# Altium project RK3399_SOM_BOARD.PrjPcb (part 4 of 4)

## Sheet SP3_PMIC.SchDoc
size A3; Date: 07.08.2025; CheckedBy: Own Check; CompanyName: No Company; DocumentNumber: ELK.PCB.0005.0005.A.A; Revision: V0.0.1; SheetNumber: 22; SheetTotal: 22
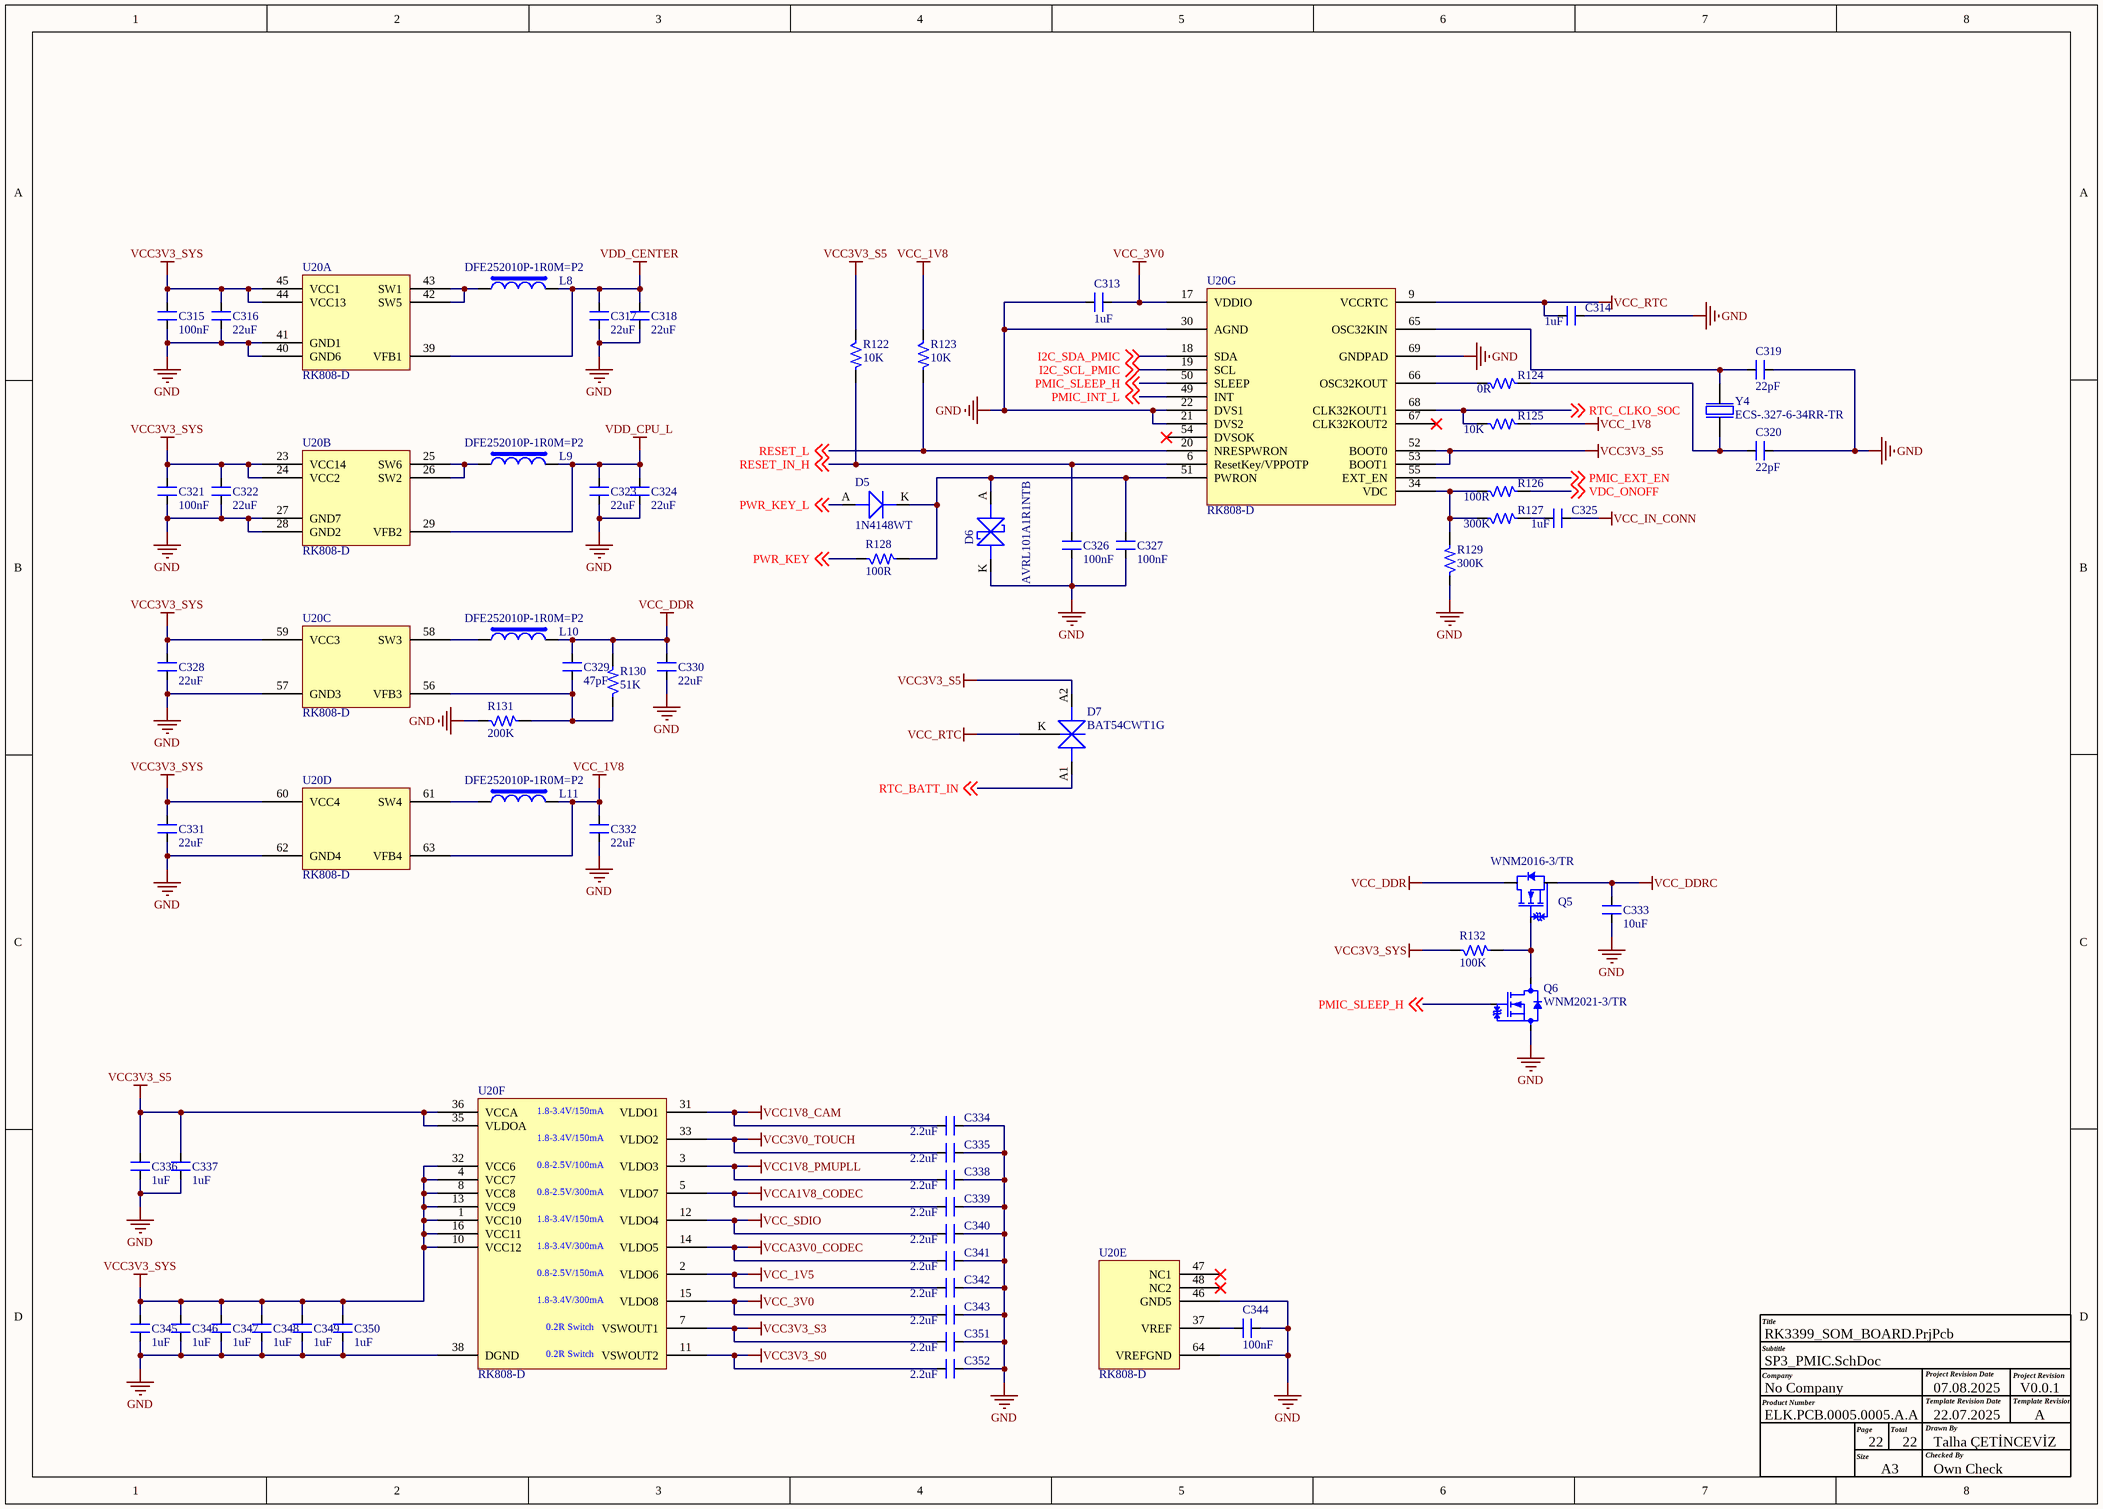
[diagram p20: SP3_PMIC.SchDoc]

### Parts
C313  1uF  [CAP_0402]
C314  1uF  [CAP_0402]
C315  100nF  [CAP_0402]
C316  22uF  [CAP_0603]
C317  22uF  [CAP_0603]
C318  22uF  [CAP_0603]
C319  22pF  [CAP_0402]
C320  22pF  [CAP_0402]
C321  100nF  [CAP_0402]
C322  22uF  [CAP_0603]
C323  22uF  [CAP_0603]
C324  22uF  [CAP_0603]
C325  1uF  [CAP_0402]
C326  100nF  [CAP_0402]
C327  100nF  [CAP_0402]
C328  22uF  [CAP_0603]
C329  47pF  [CAP_0402]
C330  22uF  [CAP_0603]
C331  22uF  [CAP_0603]
C332  22uF  [CAP_0603]
C333  10uF  [CAP_0402]
C334  2.2uF  [CAP_0402]
C335  2.2uF  [CAP_0402]
C336  1uF  [CAP_0402]
C337  1uF  [CAP_0402]
C338  2.2uF  [CAP_0402]
C339  2.2uF  [CAP_0402]
C340  2.2uF  [CAP_0402]
C341  2.2uF  [CAP_0402]
C342  2.2uF  [CAP_0402]
C343  2.2uF  [CAP_0402]
C344  100nF  [CAP_0402]
C345  1uF  [CAP_0402]
C346  1uF  [CAP_0402]
C347  1uF  [CAP_0402]
C348  1uF  [CAP_0402]
C349  1uF  [CAP_0402]
C350  1uF  [CAP_0402]
C351  2.2uF  [CAP_0402]
C352  2.2uF  [CAP_0402]
D5  1N4148WT  [DIO_SOD523]
D6  AVRL101A1R1NTB  [DIO_0402_SMD]
D7  BAT54CWT1G  [DIO_SOT-323-3]
L8  DFE252010P-1R0M=P2  [IND_1008]
L9  DFE252010P-1R0M=P2  [IND_1008]
L10  DFE252010P-1R0M=P2  [IND_1008]
L11  DFE252010P-1R0M=P2  [IND_1008]
Q5  WNM2016-3/TR  [SOT 23-3]
Q6  WNM2021-3/TR  [SOT-323-3]
R122  10K  [RES_0402]
R123  10K  [RES_0402]
R124  0R  [RES_0402]
R125  10K  [RES_0402]
R126  100R  [RES_0402]
R127  300K  [RES_0402]
R128  100R  [RES_0402]
R129  300K  [RES_0402]
R130  51K  [RES_0402]
R131  200K  [RES_0402]
R132  100K  [RES_0402]
U20  RK808-D  [QFN68_13.7_220.4X220.4_SMD]  (parts A,B,C,D,E,F,G of 7)
Y4  ECS-.327-6-34RR-TR  [XTAL_ECS-.327-6-34RR-TR]

### Nets
GND: C313.2 C314.1 C315.1 C316.1 C317.1 C318.1 C319.1 C320.1 C321.1 C322.1 C323.1 C324.1 C326.1 C327.1 C328.1 C330.1 C331.1 C332.1 C333.1 C334.2 C335.2 C336.1 C337.1 C338.2 C339.2 C340.2 C341.2 C342.2 C343.2 C344.1 C345.1 C346.1 C347.1 C348.1 C349.1 C350.1 C351.2 C352.2 D6.K Q6.2(S) R129.1 R131.1 U20.21(DVS2) U20.22(DVS1) U20.27(GND7) U20.28(GND2) U20.30(AGND) U20.38(DGND) U20.40(GND6) U20.41(GND1) U20.46(GND5) U20.57(GND3) U20.62(GND4) U20.64(VREFGND) U20.69(GNDPAD)
VCC1V8_CAM: C334.1 U20.31(VLDO1)
VCC1V8_PMUPLL: C338.1 U20.3(VLDO3)
VCC3V0_TOUCH: C335.1 U20.33(VLDO2)
VCC3V3_S0: C352.1 U20.11(VSWOUT2)
VCC3V3_S3: C351.1 U20.7(VSWOUT1)
VCC3V3_S5: C336.2 C337.2 D7.A2 R122.1 U20.35(VLDOA) U20.36(VCCA) U20.52(BOOT0) U20.53(BOOT1)
VCC3V3_SYS: C315.2 C316.2 C321.2 C322.2 C328.2 C331.2 C345.2 C346.2 C347.2 C348.2 C349.2 C350.2 R132.1 U20.1(VCC10) U20.4(VCC7) U20.8(VCC8) U20.10(VCC12) U20.13(VCC9) U20.16(VCC11) U20.23(VCC14) U20.24(VCC2) U20.32(VCC6) U20.44(VCC13) U20.45(VCC1) U20.59(VCC3) U20.60(VCC4)
VCC_1V5: C342.1 U20.2(VLDO6)
VCC_1V8: C332.2 L11.2 R123.1 R125.2 U20.63(VFB4)
VCC_3V0: C313.1 C343.1 U20.15(VLDO8) U20.17(VDDIO)
VCC_DDR: C329.2 C330.2 L10.2 Q5.3(D) R130.2
VCC_DDRC: C333.2 Q5.2(S)
VCC_IN_CONN: C325.1
VCC_RTC: C314.2 D7.K U20.9(VCCRTC)
VCC_SDIO: C340.1 U20.12(VLDO4)
VCCA1V8_CODEC: C339.1 U20.5(VLDO7)
VCCA3V0_CODEC: C341.1 U20.14(VLDO5)
VDD_CENTER: C317.2 C318.2 L8.2 U20.39(VFB1)
VDD_CPU_L: C323.2 C324.2 L9.2 U20.29(VFB2)
I2C_SCL_PMIC: U20.19(SCL) ; off-sheet I2C_SCL_PMIC
I2C_SDA_PMIC: U20.18(SDA) ; off-sheet I2C_SDA_PMIC
PMIC_EXT_EN: U20.55(EXT_EN) ; off-sheet PMIC_EXT_EN
PMIC_INT_L: U20.49(INT) ; off-sheet PMIC_INT_L
PMIC_SLEEP_H: Q6.1(G) U20.50(SLEEP) ; off-sheet PMIC_SLEEP_H
PWR_KEY: R128.1 ; off-sheet PWR_KEY
PWR_KEY_L: D5.A(ANODE) ; off-sheet PWR_KEY_L
RESET_IN_H: C326.2 R122.2 U20.6(ResetKey/VPPOTP) ; off-sheet RESET_IN_H
RESET_L: R123.2 U20.20(NRESPWRON) ; off-sheet RESET_L
RTC_BATT_IN: D7.A1 ; off-sheet RTC_BATT_IN
RTC_CLKO_SOC: R125.1 U20.68(CLK32KOUT1) ; off-sheet RTC_CLKO_SOC
VDC_ONOFF: R126.2 ; off-sheet VDC_ONOFF
NetC319_2: C319.2 U20.65(OSC32KIN) Y4.1
NetC320_2: C320.2 R124.2 Y4.2
NetC325_2: C325.2 R127.2
NetC327_2: C327.2 D5.K(CATHODE) D6.A R128.2 U20.51(PWRON)
NetC329_1: C329.1 R130.1 R131.2 U20.56(VFB3)
NetC344_2: C344.2 U20.37(VREF)
NetL8_1: L8.1 U20.42(SW5) U20.43(SW1)
NetL9_1: L9.1 U20.25(SW6) U20.26(SW2)
NetL10_1: L10.1 U20.58(SW3)
NetL11_1: L11.1 U20.61(SW4)
NetQ5_1: Q5.1(G) Q6.3(D) R132.2
NetR124_1: R124.1 U20.66(OSC32KOUT)
NetR126_1: R126.1 R127.1 R129.2 U20.34(VDC)

Not connected (* = marked no-connect by the designer): U20 47(NC1)* 48(NC2)* 54(DVSOK)* 67(CLK32KOUT2)*

### Notes on the sheet
- Title
- Company
- Product Number
- Subtitle
- Project Revision Date
- Template Revision Date
- Project Revision
- Template Revision
- Size
- Page
- A3
- Total
- Checked By
- Drawn By
- 22.07.2025
- Talha ÇETİNCEVİZ
- A
- (in symbol IC_RK808-D-QFN68, part F) 1.8-3.4V/150mA; 0.8-2.5V/100mA; 0.8-2.5V/300mA; 1.8-3.4V/300mA; 0.8-2.5V/150mA; 0.2R Switch

### Library data of the parts
C313 C314 C325 C336 C337 C345-C350 = CAP_1uF-16V-10%-0402: 1µF ±10% 16V Ceramic Capacitor X5R 0402 (1005 Metric); Manufacturer: Knowles Novacap; Manufacturer Part Number: 0402BW105K160YT; Case/Package: 0402; Supplier-1: Digikey
C315 C321 C326 C327 C344 = CAP_100nF-25V-10%-0402: 0.1µF ±10% 25V Ceramic Capacitor X7R 0402 (1005 Metric); Manufacturer: Walsin Technology Corporation; Manufacturer Part Number: 0402B104K250CT; Case/Package: 0402; Supplier-1: Digikey
C316-C318 C322-C324 C328 C330-C332 = CAP_22uF-10V-20%-0603: 22µF ±20% 10V Ceramic Capacitor X5R 0603 (1608 Metric); Manufacturer: Murata Electronics; Manufacturer Part Number: GRM188R61A226ME15D; Case/Package: 0603; Supplier-1: Digikey
C319 C320 = CAP_22pF-10V-10%-0402: 22pF ±10% 10V Ceramic Capacitor C0G, NP0 0402 (1005 Metric); Manufacturer: KEMET; Manufacturer Part Number: C0402C220K8GACTU; Case/Package: 0402; Supplier-1: Digikey
C329 = CAP_47pF-10V-10%-0402: 47pF ±10% 10V Ceramic Capacitor C0G, NP0 0402 (1005 Metric); Manufacturer: KEMET; Manufacturer Part Number: C0402C470K8GAC7867; Case/Package: 0402; Supplier-1: Supplier-1
C333 = CAP_10uF-10V-20%-0402: 10µF ±20% 10V Ceramic Capacitor X5R 0402 (1005 Metric); Manufacturer Part Number: CL05A106MP5NUNC; Manufacturer: Samsung Electro-Mechanics; Case/Package: 0402; Supplier-1: Digikey
C334 C335 C338-C343 C351 C352 = CAP_2.2uF-10V-10%-0402: 2.2µF ±10% 10V Ceramic Capacitor X5R 0402 (1005 Metric); Manufacturer: Murata Electronics; Manufacturer Part Number: GRM155R61A225KE95D; Case/Package: 0402; Supplier-1: Digikey
D5 = DIO_75V-200mA-SOD-523F: Diode Standard 100V 300mA (DC) Surface Mount SOD-123; Manufacturer: FAIRCHILD; Manufacturer Part Number: 1N4148WT; Case/Package: SOD123; Supplier-1: SIRICOM
D6 = DIO-T_10V-39V-0402: 39V Varistor 1 Circuit Surface Mount, MLCV 0402 (1005 Metric); Manufacturer: TDK Corporation; Manufacturer Part Number: AVRL101A1R1NTB; Supplier-1: Digikey; Case/Package: 0402
D7 = DIO-S-A_30V-200mA-SOT-323: Diode Array 1 Pair Common Cathode Schottky 30V 200mA (DC) Surface Mount SC-70, SOT-323; Manufacturer: ON Semiconductor; Manufacturer Part Number: BAT54CWT1G; Case/Package: SOT323; Supplier-1: Digikey
L8-L11 = IND_1uH-3.8A-20%-1008: 1µH Shielded Wirewound Inductor 3.8A 54mOhm Max 1008 (2520 Metric); Manufacturer: Murata Electronics; Manufacturer Part Number: DFE252010P-1R0M=P2; Case/Package: 1008; Supplier-1: Digikey
Q5 = MOSFET-N_20V-2.9A-SOT-23: N Channel 20V 2.9A 1V @ 250uA 47mΩ @ 3.6A,4.5V 700mW SOT-23(SOT-23-3) MOSFET RoHS; Manufacturer: WILLSEMI(Will Semicon); Manufacturer Part Number: WNM2016-3/TR; Case/Package: SOT-23(SOT-23-3); Supplier-1: LCSC
Q6 = MOSFET-N_20V-820mA-SOT-323: N Channel 20V 820mA 850mV @ 250uA 310mΩ @ 550mA,4.5V 310mW SOT-323(SC-70) MOSFET RoHS; Manufacturer: WILLSEMI(Will Semicon); Manufacturer Part Number: WNM2021-3/TR; Case/Package: SOT-323(SC-70); Supplier-1: LCSC
R122 R123 R125 = RES_10K-0.1W-1%-0402: 10 kOhms ±1% 0.1W, 1/10W Chip Resistor 0402 (1005 Metric) Anti-Sulfur Thin Film; Manufacturer: Vishay Beyschlag/Draloric/BC Components; Manufacturer Part Number: MCS04020C1002FE000; Case/Package: 0402; Supplier-1: Digikey
R124 = RES_0R-0.1W-1%-0402: 0 Ohms Jumper 0.1W, 1/10W Chip Resistor 0402 (1005 Metric) Automotive AEC-Q200 Thick Film; Manufacturer: Panasonic Electronic Components; Manufacturer Part Number: ERJ-2GE0R00X; Case/Package: 0402; Supplier-1: Digikey
R126 R128 = RES_100R-0.1W-1%-0402: 100 Ohms ±1% 0.1W, 1/10W Chip Resistor 0402 (1005 Metric) Automotive AEC-Q200, Moisture Resistant Thick Film; Manufacturer: KOA Speer Electronics, Inc.; Manufacturer Part Number: RK73H1ETTP1000F; Case/Package: 0402; Supplier-1: Digikey
R127 R129 = RES_300K-0.1W-1%-0402: 300 kOhms ±1% 0.1W, 1/10W Chip Resistor 0402 (1005 Metric) Automotive AEC-Q200 Thick Film; Manufacturer: Panasonic Electronic Components; Manufacturer Part Number: ERJ-2RKF3003X; Case/Package: 0402; Supplier-1: Digikey
R130 = RES_51K-0.1W-1%-0402: 51 kOhms ±1% 0.1W, 1/10W Chip Resistor 0402 (1005 Metric) Automotive AEC-Q200 Thick Film; Manufacturer: Panasonic Electronic Components; Manufacturer Part Number: ERJ-2RKF5102X; Case/Package: 0402; Supplier-1: Digikey
R131 = RES_200K-0.1W-1%-0402: 200 kOhms ±1% 0.1W, 1/10W Chip Resistor 0402 (1005 Metric) Automotive AEC-Q200 Thick Film; Manufacturer: Panasonic Electronic Components; Manufacturer Part number: ERJ-2RKF2003X; Case/Package: 0402; Supplier-1: Digikey
R132 = RES_100K-0.1W-1%-0402: 100 kOhms ±1% 0.1W, 1/10W Chip Resistor 0402 (1005 Metric) Anti-Sulfur Thin Film; Manufacturer: Vishay Beyschlag/Draloric/BC Components; Manufacturer Part Number: MCS04020C1003FE000; Case/Package: 0402; Supplier-1: Digikey
U20 = IC_RK808-D-QFN68: The RK808 is a complete power supply solution for Portable systems.; Manufacturer: Rockchip; Manufacturer Part Number: RK808-D; Case/Package: QFN68; Supplier-1: Rockchip
Y4 = XTAL_32.768Khz-22pF-SMD: 32.768kHz ±20ppm Crystal 12pF 80 kOhms 2-SMD, No Lead; Manufacturer: Ecliptek; Manufacturer Part Number: ECS-.327-6-34RR-TR; Case/Package: 0603; Supplier-1: Digikey

## Nets that join several sheets
GND: Cover (6 pins), LPDDR4 SDRAM-1 (104 pins), LPDDR4 SDRAM-2 (104 pins), EMMC (19 pins), Wifi_Module (29 pins), RK3399_Power_Pins (282 pins), RK3399_SDRAM (20 pins), RK3399_PMU (14 pins), RK3399_EMMC_ADC_PCIE (9 pins), RK3399_EDP_CSI_HDMI (18 pins), RK3399_USB2_TYPEC_USIC (17 pins), RK3399_DVP_MIPI_CSI (6 pins), RK3399_RGMII_SDIO_SPI_GPIO (10 pins), USB_TYPEC_Connector (23 pins), RGMII_PHY (29 pins), PushButton_SYS-LED (Q1.2 SW2.1 SW3.1), DDR4_260PIN_Connector (70 pins), SP1_TYPEC_PWR_IN (34 pins), SP2_BUCKs_GPU_LOG_CPU-B (45 pins), SP3_PMIC (55 pins)
VCC1V8_CAM: DDR4_260PIN_Connector (J4.107), SP3_PMIC (C334.1 U20.31)
VCC3V3_S3: EMMC (7 pins), RK3399_USB2_TYPEC_USIC (6 pins), RK3399_RGMII_SDIO_SPI_GPIO (C229.2 U8.J23), RGMII_PHY (C268.2 C269.2 R90.1), SP3_PMIC (C351.1 U20.7)
VCC3V3_S5: SP1_TYPEC_PWR_IN (C288.2 C289.2 C290.2 U15.5), SP3_PMIC (8 pins)
VCC3V3_SYS: Wifi_Module (5 pins), RK3399_PMU (C191.2 U9.1), USB_TYPEC_Connector (C250.2 U10.4), PushButton_SYS-LED (SW1.1), DDR4_260PIN_Connector (5 pins), SP1_TYPEC_PWR_IN (5 pins), SP2_BUCKs_GPU_LOG_CPU-B (21 pins), SP3_PMIC (26 pins)
VCC5V0_SYS: Wifi_Module (C108.1 U6.1 U6.6), USB_TYPEC_Connector (5 pins), PushButton_SYS-LED (R92.2), DDR4_260PIN_Connector (J4.13 J4.15 J4.17 J4.19), SP1_TYPEC_PWR_IN (8 pins)
VCC_0V9: RK3399_SDRAM (FB3.2 FB4.2), RK3399_PMU (FB8.1 U8.T24), RK3399_EMMC_ADC_PCIE (C195.2 C200.2 U8.L24 U8.W24), RK3399_EDP_CSI_HDMI (6 pins), RK3399_USB2_TYPEC_USIC (8 pins), SP2_BUCKs_GPU_LOG_CPU-B (C307.2 L6.2 R110.2)
VCC_1V5: RK3399_RGMII_SDIO_SPI_GPIO (C232.2 C235.2 U8.AC8 U8.N23), SP3_PMIC (C342.1 U20.2)
VCC_1V8: EMMC (9 pins), RK3399_PMU (FB7.2 FB9.1), RK3399_EMMC_ADC_PCIE (5 pins), RK3399_EDP_CSI_HDMI (8 pins), RK3399_USB2_TYPEC_USIC (6 pins), RK3399_DVP_MIPI_CSI (12 pins), RK3399_RGMII_SDIO_SPI_GPIO (C230.2 C233.2 U8.AB8 U8.J22), DDR4_260PIN_Connector (J4.29 J4.31), SP2_BUCKs_GPU_LOG_CPU-B (R106.2 R107.2 R112.2), SP3_PMIC (5 pins)
VCC_3V0: RK3399_RGMII_SDIO_SPI_GPIO (10 pins), SP2_BUCKs_GPU_LOG_CPU-B (R118.1), SP3_PMIC (C313.1 C343.1 U20.15 U20.17)
VCC_DDR: LPDDR4 SDRAM-1 (43 pins), LPDDR4 SDRAM-2 (43 pins), RK3399_SDRAM (44 pins), SP3_PMIC (5 pins)
VCC_DDRC: LPDDR4 SDRAM-1 (41 pins), LPDDR4 SDRAM-2 (41 pins), SP3_PMIC (C333.2 Q5.2)
VCC_IN_CONN: DDR4_260PIN_Connector (8 pins), SP1_TYPEC_PWR_IN (10 pins), SP3_PMIC (C325.1)
VCC_SDIO: RK3399_EMMC_ADC_PCIE (C193.2 U8.T23), SP3_PMIC (C340.1 U20.12)
VCCA1V8_CODEC: RK3399_RGMII_SDIO_SPI_GPIO (5 pins), SP3_PMIC (C339.1 U20.5)
VDD_CENTER: RK3399_Power_Pins (19 pins), SP3_PMIC (C317.2 C318.2 L8.2 U20.39)
VDD_CPU_B: RK3399_Power_Pins (22 pins), SP2_BUCKs_GPU_LOG_CPU-B (6 pins)
VDD_CPU_L: RK3399_Power_Pins (13 pins), SP3_PMIC (C323.2 C324.2 L9.2 U20.29)
VDD_GPU: RK3399_Power_Pins (37 pins), SP2_BUCKs_GPU_LOG_CPU-B (5 pins)
VDD_LOG: RK3399_Power_Pins (21 pins), SP2_BUCKs_GPU_LOG_CPU-B (C310.2 L7.2 R111.2)
ADC_IN0: RK3399_EMMC_ADC_PCIE (U8.AG26), DDR4_260PIN_Connector (J4.26)
ADC_IN2: RK3399_EMMC_ADC_PCIE (U8.AG25), DDR4_260PIN_Connector (J4.28)
ADC_IN3: RK3399_EMMC_ADC_PCIE (U8.AG28), DDR4_260PIN_Connector (J4.30)
CPU_B_SLEEP: RK3399_RGMII_SDIO_SPI_GPIO (U8.M27), SP2_BUCKs_GPU_LOG_CPU-B (U17.A1)
DDR0_A0: LPDDR4 SDRAM-1 (U1.H2 U1.R2), RK3399_SDRAM (U8.F2)
DDR0_A1: LPDDR4 SDRAM-1 (U1.J2 U1.P2), RK3399_SDRAM (U8.F1)
DDR0_A2: LPDDR4 SDRAM-1 (U1.H9 U1.R9), RK3399_SDRAM (U8.G1)
DDR0_A3: LPDDR4 SDRAM-1 (U1.H10 U1.R10), RK3399_SDRAM (U8.G2)
DDR0_A4: LPDDR4 SDRAM-1 (U1.H11 U1.R11), RK3399_SDRAM (U8.H2)
DDR0_A5: LPDDR4 SDRAM-1 (U1.J11 U1.P11), RK3399_SDRAM (U8.H1)
DDR0_CKE0: LPDDR4 SDRAM-1 (U1.J4 U1.P4), RK3399_SDRAM (U8.E1)
DDR0_CKE1: LPDDR4 SDRAM-1 (U1.J5 U1.P5), RK3399_SDRAM (U8.F5)
DDR0_CLKA_N: LPDDR4 SDRAM-1 (U1.J9), RK3399_SDRAM (U8.J4)
DDR0_CLKA_P: LPDDR4 SDRAM-1 (U1.J8), RK3399_SDRAM (U8.H4)
DDR0_CLKB_N: LPDDR4 SDRAM-1 (U1.P9), RK3399_SDRAM (U8.J5)
DDR0_CLKB_P: LPDDR4 SDRAM-1 (U1.P8), RK3399_SDRAM (U8.H5)
DDR0_CS0A: LPDDR4 SDRAM-1 (U1.H4), RK3399_SDRAM (U8.M6)
DDR0_CS1A: LPDDR4 SDRAM-1 (U1.H3), RK3399_SDRAM (U8.B1)
DDR0_CS2A: LPDDR4 SDRAM-1 (U1.R4), RK3399_SDRAM (U8.M5)
DDR0_CS3A: LPDDR4 SDRAM-1 (U1.R3), RK3399_SDRAM (U8.C2)
DDR0_D0: LPDDR4 SDRAM-1 (U1.B2), RK3399_SDRAM (U8.AB2)
DDR0_D1: LPDDR4 SDRAM-1 (U1.C2), RK3399_SDRAM (U8.AB1)
DDR0_D2: LPDDR4 SDRAM-1 (U1.E2), RK3399_SDRAM (U8.AA2)
DDR0_D3: LPDDR4 SDRAM-1 (U1.F2), RK3399_SDRAM (U8.AA1)
DDR0_D4: LPDDR4 SDRAM-1 (U1.F4), RK3399_SDRAM (U8.Y2)
DDR0_D5: LPDDR4 SDRAM-1 (U1.E4), RK3399_SDRAM (U8.Y1)
DDR0_D6: LPDDR4 SDRAM-1 (U1.C4), RK3399_SDRAM (U8.W1)
DDR0_D7: LPDDR4 SDRAM-1 (U1.B4), RK3399_SDRAM (U8.W2)
DDR0_D8: LPDDR4 SDRAM-1 (U1.B11), RK3399_SDRAM (U8.AF2)
DDR0_D9: LPDDR4 SDRAM-1 (U1.C11), RK3399_SDRAM (U8.AE2)
DDR0_D10: LPDDR4 SDRAM-1 (U1.E11), RK3399_SDRAM (U8.AF1)
DDR0_D11: LPDDR4 SDRAM-1 (U1.F11), RK3399_SDRAM (U8.AD2)
DDR0_D12: LPDDR4 SDRAM-1 (U1.F9), RK3399_SDRAM (U8.AE1)
DDR0_D13: LPDDR4 SDRAM-1 (U1.E9), RK3399_SDRAM (U8.AD1)
DDR0_D14: LPDDR4 SDRAM-1 (U1.C9), RK3399_SDRAM (U8.AC1)
DDR0_D15: LPDDR4 SDRAM-1 (U1.B9), RK3399_SDRAM (U8.AC2)
DDR0_D16: LPDDR4 SDRAM-1 (U1.AA2), RK3399_SDRAM (U8.V1)
DDR0_D17: LPDDR4 SDRAM-1 (U1.Y2), RK3399_SDRAM (U8.V2)
DDR0_D18: LPDDR4 SDRAM-1 (U1.V2), RK3399_SDRAM (U8.U1)
DDR0_D19: LPDDR4 SDRAM-1 (U1.U2), RK3399_SDRAM (U8.U2)
DDR0_D20: LPDDR4 SDRAM-1 (U1.U4), RK3399_SDRAM (U8.T1)
DDR0_D21: LPDDR4 SDRAM-1 (U1.V4), RK3399_SDRAM (U8.T2)
DDR0_D22: LPDDR4 SDRAM-1 (U1.Y4), RK3399_SDRAM (U8.R2)
DDR0_D23: LPDDR4 SDRAM-1 (U1.AA4), RK3399_SDRAM (U8.R1)
DDR0_D24: LPDDR4 SDRAM-1 (U1.AA11), RK3399_SDRAM (U8.P1)
DDR0_D25: LPDDR4 SDRAM-1 (U1.Y11), RK3399_SDRAM (U8.P2)
DDR0_D26: LPDDR4 SDRAM-1 (U1.V11), RK3399_SDRAM (U8.N1)
DDR0_D27: LPDDR4 SDRAM-1 (U1.U11), RK3399_SDRAM (U8.M1)
DDR0_D28: LPDDR4 SDRAM-1 (U1.U9), RK3399_SDRAM (U8.N2)
DDR0_D29: LPDDR4 SDRAM-1 (U1.V9), RK3399_SDRAM (U8.L1)
DDR0_D30: LPDDR4 SDRAM-1 (U1.Y9), RK3399_SDRAM (U8.M2)
DDR0_D31: LPDDR4 SDRAM-1 (U1.AA9), RK3399_SDRAM (U8.L2)
DDR0_DM0: LPDDR4 SDRAM-1 (U1.C3), RK3399_SDRAM (U8.Y5)
DDR0_DM1: LPDDR4 SDRAM-1 (U1.C10), RK3399_SDRAM (U8.AC5)
DDR0_DM2: LPDDR4 SDRAM-1 (U1.Y3), RK3399_SDRAM (U8.U5)
DDR0_DM3: LPDDR4 SDRAM-1 (U1.Y10), RK3399_SDRAM (U8.P5)
DDR0_DQS0_N: LPDDR4 SDRAM-1 (U1.E3), RK3399_SDRAM (U8.AA4)
DDR0_DQS0_P: LPDDR4 SDRAM-1 (U1.D3), RK3399_SDRAM (U8.Y4)
DDR0_DQS1_N: LPDDR4 SDRAM-1 (U1.E10), RK3399_SDRAM (U8.AD4)
DDR0_DQS1_P: LPDDR4 SDRAM-1 (U1.D10), RK3399_SDRAM (U8.AC4)
DDR0_DQS2_N: LPDDR4 SDRAM-1 (U1.V3), RK3399_SDRAM (U8.V4)
DDR0_DQS2_P: LPDDR4 SDRAM-1 (U1.W3), RK3399_SDRAM (U8.U4)
DDR0_DQS3_N: LPDDR4 SDRAM-1 (U1.V10), RK3399_SDRAM (U8.R4)
DDR0_DQS3_P: LPDDR4 SDRAM-1 (U1.W10), RK3399_SDRAM (U8.P4)
DDR0_RST: LPDDR4 SDRAM-1 (U1.T11), RK3399_SDRAM (U8.L7)
DDR1_A0: LPDDR4 SDRAM-2 (U2.H2 U2.R2), RK3399_SDRAM (U8.B10)
DDR1_A1: LPDDR4 SDRAM-2 (U2.J2 U2.P2), RK3399_SDRAM (U8.A10)
DDR1_A2: LPDDR4 SDRAM-2 (U2.H9 U2.R9), RK3399_SDRAM (U8.B9)
DDR1_A3: LPDDR4 SDRAM-2 (U2.H10 U2.R10), RK3399_SDRAM (U8.A9)
DDR1_A4: LPDDR4 SDRAM-2 (U2.H11 U2.R11), RK3399_SDRAM (U8.B8)
DDR1_A5: LPDDR4 SDRAM-2 (U2.J11 U2.P11), RK3399_SDRAM (U8.A8)
DDR1_CKE0: LPDDR4 SDRAM-2 (U2.J4 U2.P4), RK3399_SDRAM (U8.A5)
DDR1_CKE1: LPDDR4 SDRAM-2 (U2.J5 U2.P5), RK3399_SDRAM (U8.E6)
DDR1_CLKA_N: LPDDR4 SDRAM-2 (U2.J9), RK3399_SDRAM (U8.D8)
DDR1_CLKA_P: LPDDR4 SDRAM-2 (U2.J8), RK3399_SDRAM (U8.D9)
DDR1_CLKB_N: LPDDR4 SDRAM-2 (U2.P9), RK3399_SDRAM (U8.E8)
DDR1_CLKB_P: LPDDR4 SDRAM-2 (U2.P8), RK3399_SDRAM (U8.E9)
DDR1_CS0A: LPDDR4 SDRAM-2 (U2.H4), RK3399_SDRAM (U8.F12)
DDR1_CS1A: LPDDR4 SDRAM-2 (U2.H3), RK3399_SDRAM (U8.A2)
DDR1_CS2A: LPDDR4 SDRAM-2 (U2.R4), RK3399_SDRAM (U8.F11)
DDR1_CS3A: LPDDR4 SDRAM-2 (U2.R3), RK3399_SDRAM (U8.B3)
DDR1_D0: LPDDR4 SDRAM-2 (U2.B2), RK3399_SDRAM (U8.B15)
DDR1_D1: LPDDR4 SDRAM-2 (U2.C2), RK3399_SDRAM (U8.A15)
DDR1_D2: LPDDR4 SDRAM-2 (U2.E2), RK3399_SDRAM (U8.B16)
DDR1_D3: LPDDR4 SDRAM-2 (U2.F2), RK3399_SDRAM (U8.A16)
DDR1_D4: LPDDR4 SDRAM-2 (U2.F4), RK3399_SDRAM (U8.B17)
DDR1_D5: LPDDR4 SDRAM-2 (U2.E4), RK3399_SDRAM (U8.A17)
DDR1_D6: LPDDR4 SDRAM-2 (U2.C4), RK3399_SDRAM (U8.A18)
DDR1_D7: LPDDR4 SDRAM-2 (U2.B4), RK3399_SDRAM (U8.B18)
DDR1_D8: LPDDR4 SDRAM-2 (U2.B11), RK3399_SDRAM (U8.B11)
DDR1_D9: LPDDR4 SDRAM-2 (U2.C11), RK3399_SDRAM (U8.B12)
DDR1_D10: LPDDR4 SDRAM-2 (U2.E11), RK3399_SDRAM (U8.A11)
DDR1_D11: LPDDR4 SDRAM-2 (U2.F11), RK3399_SDRAM (U8.B13)
DDR1_D12: LPDDR4 SDRAM-2 (U2.F9), RK3399_SDRAM (U8.A12)
DDR1_D13: LPDDR4 SDRAM-2 (U2.E9), RK3399_SDRAM (U8.A13)
DDR1_D14: LPDDR4 SDRAM-2 (U2.C9), RK3399_SDRAM (U8.A14)
DDR1_D15: LPDDR4 SDRAM-2 (U2.B9), RK3399_SDRAM (U8.B14)
DDR1_D16: LPDDR4 SDRAM-2 (U2.AA2), RK3399_SDRAM (U8.A19)
DDR1_D17: LPDDR4 SDRAM-2 (U2.Y2), RK3399_SDRAM (U8.B19)
DDR1_D18: LPDDR4 SDRAM-2 (U2.V2), RK3399_SDRAM (U8.A20)
DDR1_D19: LPDDR4 SDRAM-2 (U2.U2), RK3399_SDRAM (U8.B20)
DDR1_D20: LPDDR4 SDRAM-2 (U2.U4), RK3399_SDRAM (U8.A21)
DDR1_D21: LPDDR4 SDRAM-2 (U2.V4), RK3399_SDRAM (U8.B21)
DDR1_D22: LPDDR4 SDRAM-2 (U2.Y4), RK3399_SDRAM (U8.B22)
DDR1_D23: LPDDR4 SDRAM-2 (U2.AA4), RK3399_SDRAM (U8.A22)
DDR1_D24: LPDDR4 SDRAM-2 (U2.AA11), RK3399_SDRAM (U8.A23)
DDR1_D25: LPDDR4 SDRAM-2 (U2.Y11), RK3399_SDRAM (U8.B23)
DDR1_D26: LPDDR4 SDRAM-2 (U2.V11), RK3399_SDRAM (U8.A24)
DDR1_D27: LPDDR4 SDRAM-2 (U2.U11), RK3399_SDRAM (U8.A25)
DDR1_D28: LPDDR4 SDRAM-2 (U2.U9), RK3399_SDRAM (U8.B24)
DDR1_D29: LPDDR4 SDRAM-2 (U2.V9), RK3399_SDRAM (U8.A26)
DDR1_D30: LPDDR4 SDRAM-2 (U2.Y9), RK3399_SDRAM (U8.B25)
DDR1_D31: LPDDR4 SDRAM-2 (U2.AA9), RK3399_SDRAM (U8.B26)
DDR1_DM0: LPDDR4 SDRAM-2 (U2.C3), RK3399_SDRAM (U8.E17)
DDR1_DM1: LPDDR4 SDRAM-2 (U2.C10), RK3399_SDRAM (U8.E14)
DDR1_DM2: LPDDR4 SDRAM-2 (U2.Y3), RK3399_SDRAM (U8.E20)
DDR1_DM3: LPDDR4 SDRAM-2 (U2.Y10), RK3399_SDRAM (U8.E23)
DDR1_DQS0_N: LPDDR4 SDRAM-2 (U2.E3), RK3399_SDRAM (U8.D17)
DDR1_DQS0_P: LPDDR4 SDRAM-2 (U2.D3), RK3399_SDRAM (U8.D18)
DDR1_DQS1_N: LPDDR4 SDRAM-2 (U2.E10), RK3399_SDRAM (U8.D14)
DDR1_DQS1_P: LPDDR4 SDRAM-2 (U2.D10), RK3399_SDRAM (U8.D15)
DDR1_DQS2_N: LPDDR4 SDRAM-2 (U2.V3), RK3399_SDRAM (U8.D20)
DDR1_DQS2_P: LPDDR4 SDRAM-2 (U2.W3), RK3399_SDRAM (U8.D21)
DDR1_DQS3_N: LPDDR4 SDRAM-2 (U2.V10), RK3399_SDRAM (U8.D23)
DDR1_DQS3_P: LPDDR4 SDRAM-2 (U2.W10), RK3399_SDRAM (U8.D24)
DDR1_RST: LPDDR4 SDRAM-2 (U2.T11), RK3399_SDRAM (U8.G11)
EDP_TX0_N: RK3399_EDP_CSI_HDMI (C202.2), DDR4_260PIN_Connector (J4.249)
EDP_TX0_P: RK3399_EDP_CSI_HDMI (C201.2), DDR4_260PIN_Connector (J4.251)
EDP_TX1_N: RK3399_EDP_CSI_HDMI (C204.2), DDR4_260PIN_Connector (J4.243)
EDP_TX1_P: RK3399_EDP_CSI_HDMI (C203.2), DDR4_260PIN_Connector (J4.245)
EDP_TX2_N: RK3399_EDP_CSI_HDMI (C206.2), DDR4_260PIN_Connector (J4.237)
EDP_TX2_P: RK3399_EDP_CSI_HDMI (C205.2), DDR4_260PIN_Connector (J4.239)
EDP_TX3_N: RK3399_EDP_CSI_HDMI (C208.2), DDR4_260PIN_Connector (J4.231)
EDP_TX3_P: RK3399_EDP_CSI_HDMI (C207.2), DDR4_260PIN_Connector (J4.233)
EDPAUX_N: RK3399_EDP_CSI_HDMI (U8.A28), DDR4_260PIN_Connector (J4.257)
EDPAUX_P: RK3399_EDP_CSI_HDMI (U8.B28), DDR4_260PIN_Connector (J4.255)
EFUSE_VQPS_EN_H: RK3399_PMU (U9.3), RK3399_RGMII_SDIO_SPI_GPIO (U8.AK3)
EMMC_CLK: EMMC (U3.M5), RK3399_EMMC_ADC_PCIE (R26.2)
EMMC_CMD: EMMC (U3.M6), RK3399_EMMC_ADC_PCIE (U8.J31)
EMMC_D0: EMMC (U3.A3), RK3399_EMMC_ADC_PCIE (U8.J28)
EMMC_D1: EMMC (U3.A4), RK3399_EMMC_ADC_PCIE (U8.J29)
EMMC_D2: EMMC (U3.A5), RK3399_EMMC_ADC_PCIE (U8.J30)
EMMC_D3: EMMC (U3.B2), RK3399_EMMC_ADC_PCIE (U8.J25)
EMMC_D4: EMMC (U3.B3), RK3399_EMMC_ADC_PCIE (U8.J26)
EMMC_D5: EMMC (U3.B4), RK3399_EMMC_ADC_PCIE (U8.J27)
EMMC_D6: EMMC (U3.B5), RK3399_EMMC_ADC_PCIE (U8.L31)
EMMC_D7: EMMC (U3.B6), RK3399_EMMC_ADC_PCIE (U8.K30)
EMMC_STRB: EMMC (U3.H5), RK3399_EMMC_ADC_PCIE (U8.K31)
GPIO0_A2: RK3399_PMU (U8.N24), DDR4_260PIN_Connector (J4.37)
GPIO0_A6/PWM3A_IR: RK3399_PMU (U8.P25), DDR4_260PIN_Connector (J4.49)
GPIO0_B5/LED1_OUT: RK3399_PMU (U8.P24), PushButton_SYS-LED (R93.1)
GPIO1_A0: RK3399_RGMII_SDIO_SPI_GPIO (U8.R25), DDR4_260PIN_Connector (J4.34)
GPIO1_A1: RK3399_RGMII_SDIO_SPI_GPIO (U8.T31), DDR4_260PIN_Connector (J4.36)
GPIO1_A2_CC_INT_L: RK3399_RGMII_SDIO_SPI_GPIO (U8.R26), USB_TYPEC_Connector (U10.5)
GPIO1_A3: RK3399_RGMII_SDIO_SPI_GPIO (U8.R27), DDR4_260PIN_Connector (J4.38)
GPIO1_A4: RK3399_RGMII_SDIO_SPI_GPIO (U8.R28), DDR4_260PIN_Connector (J4.40)
GPIO1_B5_TP_RST: RK3399_RGMII_SDIO_SPI_GPIO (U8.M24), DDR4_260PIN_Connector (J4.82)
GPIO1_C2: RK3399_RGMII_SDIO_SPI_GPIO (U8.N31), DDR4_260PIN_Connector (J4.42)
GPIO1_C4_TP_INT: RK3399_RGMII_SDIO_SPI_GPIO (U8.M29), DDR4_260PIN_Connector (J4.84)
GPIO1_C6: RK3399_RGMII_SDIO_SPI_GPIO (U8.L25), DDR4_260PIN_Connector (J4.44)
GPIO1_C7: RK3399_RGMII_SDIO_SPI_GPIO (U8.M31), DDR4_260PIN_Connector (J4.46)
GPIO1_D0: RK3399_RGMII_SDIO_SPI_GPIO (U8.L26), DDR4_260PIN_Connector (J4.48)
GPIO2_A2: RK3399_DVP_MIPI_CSI (U8.H30), DDR4_260PIN_Connector (J4.39)
GPIO2_A3: RK3399_DVP_MIPI_CSI (U8.F28), DDR4_260PIN_Connector (J4.41)
GPIO2_A4: RK3399_DVP_MIPI_CSI (U8.H29), DDR4_260PIN_Connector (J4.43)
GPIO2_A5: RK3399_DVP_MIPI_CSI (U8.F29), DDR4_260PIN_Connector (J4.45)
GPIO2_A6: RK3399_DVP_MIPI_CSI (U8.H27), DDR4_260PIN_Connector (J4.47)
GPIO2_B3_CIF_CLKOUTA: RK3399_DVP_MIPI_CSI (U8.H31), DDR4_260PIN_Connector (J4.111)
GPIO4_C0/I2C3_SDA: RK3399_RGMII_SDIO_SPI_GPIO (U8.AG6), DDR4_260PIN_Connector (J4.68)
GPIO4_C1/I2C3_SCL: RK3399_RGMII_SDIO_SPI_GPIO (U8.AL2), DDR4_260PIN_Connector (J4.66)
GPIO4_C5/SPDIF_TX: RK3399_RGMII_SDIO_SPI_GPIO (U8.AK1), DDR4_260PIN_Connector (J4.50)
GPIO4_C6/PWM1: RK3399_RGMII_SDIO_SPI_GPIO (U8.AL3), DDR4_260PIN_Connector (J4.90)
GPIO4_D2: RK3399_RGMII_SDIO_SPI_GPIO (U8.AH3), USB_TYPEC_Connector (U11.4)
GPIO4_D5_LCD_BL_EN: RK3399_RGMII_SDIO_SPI_GPIO (U8.AJ3), DDR4_260PIN_Connector (J4.78 R94.2)
GPIO4_D6_LCD_RST_H: RK3399_RGMII_SDIO_SPI_GPIO (U8.AG4), DDR4_260PIN_Connector (J4.80)
GPU_SLEEP: RK3399_RGMII_SDIO_SPI_GPIO (U8.M25), SP2_BUCKs_GPU_LOG_CPU-B (U16.A1)
HDMI_CEC: RK3399_RGMII_SDIO_SPI_GPIO (U8.AD7), DDR4_260PIN_Connector (J4.145)
HDMI_HPD: RK3399_EDP_CSI_HDMI (D1.K R29.2 U8.AE15), DDR4_260PIN_Connector (J4.147)
HDMI_TX0_N: RK3399_EDP_CSI_HDMI (U8.AL17), DDR4_260PIN_Connector (J4.157)
HDMI_TX0_P: RK3399_EDP_CSI_HDMI (U8.AK17), DDR4_260PIN_Connector (J4.159)
HDMI_TX1_N: RK3399_EDP_CSI_HDMI (U8.AL18), DDR4_260PIN_Connector (J4.163)
HDMI_TX1_P: RK3399_EDP_CSI_HDMI (U8.AK18), DDR4_260PIN_Connector (J4.165)
HDMI_TX2_N: RK3399_EDP_CSI_HDMI (U8.AL19), DDR4_260PIN_Connector (J4.169)
HDMI_TX2_P: RK3399_EDP_CSI_HDMI (U8.AK19), DDR4_260PIN_Connector (J4.171)
HDMI_TXCLK_N: RK3399_EDP_CSI_HDMI (U8.AL16), DDR4_260PIN_Connector (J4.151)
HDMI_TXCLK_P: RK3399_EDP_CSI_HDMI (U8.AK16), DDR4_260PIN_Connector (J4.153)
HOST0_D_N: RK3399_USB2_TYPEC_USIC (U8.AB31), DDR4_260PIN_Connector (J4.221)
HOST0_D_P: RK3399_USB2_TYPEC_USIC (U8.AB30), DDR4_260PIN_Connector (J4.219)
HOST1_D_N: RK3399_USB2_TYPEC_USIC (U8.AA31), DDR4_260PIN_Connector (J4.227)
HOST1_D_P: RK3399_USB2_TYPEC_USIC (U8.AA30), DDR4_260PIN_Connector (J4.225)
HP_DET_H: RK3399_RGMII_SDIO_SPI_GPIO (U8.AH5), DDR4_260PIN_Connector (J4.76)
I2C1_SCL: RK3399_RGMII_SDIO_SPI_GPIO (R62.1 U8.Y6), DDR4_260PIN_Connector (J4.53)
I2C1_SDA: RK3399_RGMII_SDIO_SPI_GPIO (R61.1 U8.AG1), DDR4_260PIN_Connector (J4.55)
I2C2_SCL: RK3399_DVP_MIPI_CSI (R43.1 U8.H25), DDR4_260PIN_Connector (J4.59)
I2C2_SDA: RK3399_DVP_MIPI_CSI (R42.1 U8.G31), DDR4_260PIN_Connector (J4.57)
I2C4_TPSCL: RK3399_RGMII_SDIO_SPI_GPIO (R47.1 U8.P30), USB_TYPEC_Connector (U10.6), DDR4_260PIN_Connector (J4.70)
I2C4_TPSDA: RK3399_RGMII_SDIO_SPI_GPIO (R46.1 U8.P31), USB_TYPEC_Connector (U10.7), DDR4_260PIN_Connector (J4.72)
I2C7_SCL_HDMI: RK3399_DVP_MIPI_CSI (R45.1 U8.H28), DDR4_260PIN_Connector (J4.61)
I2C7_SDA_HDMI: RK3399_DVP_MIPI_CSI (R44.1 U8.G30), DDR4_260PIN_Connector (J4.63)
I2C_SCL_PMIC: RK3399_RGMII_SDIO_SPI_GPIO (R49.1 U8.N30), SP2_BUCKs_GPU_LOG_CPU-B (U16.A3 U17.A3), SP3_PMIC (U20.19)
I2C_SDA_PMIC: RK3399_RGMII_SDIO_SPI_GPIO (R48.1 U8.M26), SP2_BUCKs_GPU_LOG_CPU-B (U16.B1 U17.B1), SP3_PMIC (U20.18)
I2S0_LRCK_RX: RK3399_RGMII_SDIO_SPI_GPIO (U8.AF4), DDR4_260PIN_Connector (J4.69)
I2S0_LRCK_TX: RK3399_RGMII_SDIO_SPI_GPIO (U8.AJ2), DDR4_260PIN_Connector (J4.71)
I2S0_SCLK: RK3399_RGMII_SDIO_SPI_GPIO (U8.AG3), DDR4_260PIN_Connector (J4.67)
I2S0_SDI0: RK3399_RGMII_SDIO_SPI_GPIO (U8.Y7), DDR4_260PIN_Connector (J4.73)
I2S0_SDI1SDO3: RK3399_RGMII_SDIO_SPI_GPIO (U8.AE5), DDR4_260PIN_Connector (J4.75)
I2S0_SDI2SDO2: RK3399_RGMII_SDIO_SPI_GPIO (U8.AA6), DDR4_260PIN_Connector (J4.77)
I2S0_SDI3SDO1: RK3399_RGMII_SDIO_SPI_GPIO (U8.AH2), DDR4_260PIN_Connector (J4.79)
I2S0_SDO0: RK3399_RGMII_SDIO_SPI_GPIO (U8.AH1), DDR4_260PIN_Connector (J4.81)
I2S1_LRCK_RX: RK3399_RGMII_SDIO_SPI_GPIO (U8.AA7), DDR4_260PIN_Connector (J4.91)
I2S1_LRCK_TX: RK3399_RGMII_SDIO_SPI_GPIO (U8.AJ1), DDR4_260PIN_Connector (J4.93)
I2S1_SCLK: RK3399_RGMII_SDIO_SPI_GPIO (U8.AF3), DDR4_260PIN_Connector (J4.89)
I2S1_SDI0: RK3399_RGMII_SDIO_SPI_GPIO (U8.AD6), DDR4_260PIN_Connector (J4.95)
I2S1_SDO0: RK3399_RGMII_SDIO_SPI_GPIO (U8.AC6), DDR4_260PIN_Connector (J4.97)
I2S_CLK: RK3399_RGMII_SDIO_SPI_GPIO (U8.AC7), DDR4_260PIN_Connector (J4.85)
LAN_LED0_AD0: RGMII_PHY (R88.2 U12.34), DDR4_260PIN_Connector (J4.232)
LAN_LED0_AD1: RGMII_PHY (R77.1 U12.35), DDR4_260PIN_Connector (J4.234)
LOG_DVS_PWM: RK3399_RGMII_SDIO_SPI_GPIO (U8.M28), SP2_BUCKs_GPU_LOG_CPU-B (R116.2 R118.2)
MAC_COL: RK3399_RGMII_SDIO_SPI_GPIO (U8.D27), RGMII_PHY (R79.1 U12.33)
MAC_CRS: RK3399_RGMII_SDIO_SPI_GPIO (U8.B27), RGMII_PHY (C263.1 R71.1 U12.29)
MAC_MCLK: RK3399_RGMII_SDIO_SPI_GPIO (R54.2), RGMII_PHY (R72.1)
MAC_MDC: RK3399_RGMII_SDIO_SPI_GPIO (U8.E29), RGMII_PHY (U12.30)
MAC_MDIO: RK3399_RGMII_SDIO_SPI_GPIO (U8.G26), RGMII_PHY (R69.1 U12.31)
MAC_RXCLK: RK3399_RGMII_SDIO_SPI_GPIO (U8.F25), RGMII_PHY (R74.1)
MAC_RXD0: RK3399_RGMII_SDIO_SPI_GPIO (U8.E26), RGMII_PHY (R84.2 U12.14)
MAC_RXD1: RK3399_RGMII_SDIO_SPI_GPIO (U8.F27), RGMII_PHY (R80.1 R81.2 U12.16)
MAC_RXD2: RK3399_RGMII_SDIO_SPI_GPIO (U8.E30), RGMII_PHY (R86.2 U12.17)
MAC_RXD3: RK3399_RGMII_SDIO_SPI_GPIO (U8.E25), RGMII_PHY (R87.2 U12.18)
MAC_RXDV: RK3399_RGMII_SDIO_SPI_GPIO (U8.C27), RGMII_PHY (R78.1 U12.13)
MAC_RXER: RK3399_RGMII_SDIO_SPI_GPIO (U8.F23), RGMII_PHY (R70.1 U12.20)
MAC_TXCLK: RK3399_RGMII_SDIO_SPI_GPIO (R56.2), RGMII_PHY (R76.1)
MAC_TXD0: RK3399_RGMII_SDIO_SPI_GPIO (R52.2), RGMII_PHY (U12.23)
MAC_TXD1: RK3399_RGMII_SDIO_SPI_GPIO (R53.2), RGMII_PHY (U12.24)
MAC_TXD2: RK3399_RGMII_SDIO_SPI_GPIO (R50.2), RGMII_PHY (U12.25)
MAC_TXD3: RK3399_RGMII_SDIO_SPI_GPIO (R51.2), RGMII_PHY (U12.26)
MAC_TXEN: RK3399_RGMII_SDIO_SPI_GPIO (R55.2), RGMII_PHY (U12.27)
MDI0_N: RGMII_PHY (U12.2), DDR4_260PIN_Connector (J4.256)
MDI0_P: RGMII_PHY (U12.1), DDR4_260PIN_Connector (J4.258)
MDI1_N: RGMII_PHY (U12.5), DDR4_260PIN_Connector (J4.250)
MDI1_P: RGMII_PHY (U12.4), DDR4_260PIN_Connector (J4.252)
MDI2_N: RGMII_PHY (U12.8), DDR4_260PIN_Connector (J4.244)
MDI2_P: RGMII_PHY (U12.7), DDR4_260PIN_Connector (J4.246)
MDI3_N: RGMII_PHY (U12.11), DDR4_260PIN_Connector (J4.238)
MDI3_P: RGMII_PHY (U12.10), DDR4_260PIN_Connector (J4.240)
MIPI_CSI0_PWM: RK3399_RGMII_SDIO_SPI_GPIO (U8.AF8), DDR4_260PIN_Connector (J4.101)
MIPI_CSI0_RST: RK3399_RGMII_SDIO_SPI_GPIO (U8.AD9), DDR4_260PIN_Connector (J4.99)
MIPI_CSI1_PWN: RK3399_PMU (U8.V26), DDR4_260PIN_Connector (J4.105)
MIPI_CSI1_RST: RK3399_PMU (U8.U28), DDR4_260PIN_Connector (J4.103)
MIPI_RX0_CLK_N: RK3399_DVP_MIPI_CSI (U8.AL13), DDR4_260PIN_Connector (J4.127)
MIPI_RX0_CLK_P: RK3399_DVP_MIPI_CSI (U8.AK13), DDR4_260PIN_Connector (J4.129)
MIPI_RX0_D0_N: RK3399_DVP_MIPI_CSI (U8.AL15), DDR4_260PIN_Connector (J4.139)
MIPI_RX0_D0_P: RK3399_DVP_MIPI_CSI (U8.AK15), DDR4_260PIN_Connector (J4.141)
MIPI_RX0_D1_N: RK3399_DVP_MIPI_CSI (U8.AL14), DDR4_260PIN_Connector (J4.133)
MIPI_RX0_D1_P: RK3399_DVP_MIPI_CSI (U8.AK14), DDR4_260PIN_Connector (J4.135)
MIPI_RX0_D2_N: RK3399_DVP_MIPI_CSI (U8.AL12), DDR4_260PIN_Connector (J4.121)
MIPI_RX0_D2_P: RK3399_DVP_MIPI_CSI (U8.AK12), DDR4_260PIN_Connector (J4.123)
MIPI_RX0_D3_N: RK3399_DVP_MIPI_CSI (U8.AL11), DDR4_260PIN_Connector (J4.115)
MIPI_RX0_D3_P: RK3399_DVP_MIPI_CSI (U8.AK11), DDR4_260PIN_Connector (J4.117)
MIPI_TX0_CLK_N: RK3399_EDP_CSI_HDMI (U8.AH12), DDR4_260PIN_Connector (J4.160)
MIPI_TX0_CLK_P: RK3399_EDP_CSI_HDMI (U8.AG12), DDR4_260PIN_Connector (J4.162)
MIPI_TX0_D0_N: RK3399_EDP_CSI_HDMI (U8.AH15), DDR4_260PIN_Connector (J4.172)
MIPI_TX0_D0_P: RK3399_EDP_CSI_HDMI (U8.AG15), DDR4_260PIN_Connector (J4.174)
MIPI_TX0_D1_N: RK3399_EDP_CSI_HDMI (U8.AH14), DDR4_260PIN_Connector (J4.166)
MIPI_TX0_D1_P: RK3399_EDP_CSI_HDMI (U8.AG14), DDR4_260PIN_Connector (J4.168)
MIPI_TX0_D2_N: RK3399_EDP_CSI_HDMI (U8.AH11), DDR4_260PIN_Connector (J4.154)
MIPI_TX0_D2_P: RK3399_EDP_CSI_HDMI (U8.AG11), DDR4_260PIN_Connector (J4.156)
MIPI_TX0_D3_N: RK3399_EDP_CSI_HDMI (U8.AH9), DDR4_260PIN_Connector (J4.148)
MIPI_TX0_D3_P: RK3399_EDP_CSI_HDMI (U8.AG9), DDR4_260PIN_Connector (J4.150)
MIPI_TX1/RX1_CLK_N: RK3399_DVP_MIPI_CSI (U8.AL8), DDR4_260PIN_Connector (J4.128)
MIPI_TX1/RX1_CLK_P: RK3399_DVP_MIPI_CSI (U8.AK8), DDR4_260PIN_Connector (J4.130)
MIPI_TX1/RX1_D0_N: RK3399_DVP_MIPI_CSI (U8.AL6), DDR4_260PIN_Connector (J4.116)
MIPI_TX1/RX1_D0_P: RK3399_DVP_MIPI_CSI (U8.AK6), DDR4_260PIN_Connector (J4.118)
MIPI_TX1/RX1_D1_N: RK3399_DVP_MIPI_CSI (U8.AL7), DDR4_260PIN_Connector (J4.122)
MIPI_TX1/RX1_D1_P: RK3399_DVP_MIPI_CSI (U8.AK7), DDR4_260PIN_Connector (J4.124)
MIPI_TX1/RX1_D2_N: RK3399_DVP_MIPI_CSI (U8.AL9), DDR4_260PIN_Connector (J4.134)
MIPI_TX1/RX1_D2_P: RK3399_DVP_MIPI_CSI (U8.AK9), DDR4_260PIN_Connector (J4.136)
MIPI_TX1/RX1_D3_N: RK3399_DVP_MIPI_CSI (U8.AL10), DDR4_260PIN_Connector (J4.140)
MIPI_TX1/RX1_D3_P: RK3399_DVP_MIPI_CSI (U8.AK10), DDR4_260PIN_Connector (J4.142)
OTP_OUT_H: RK3399_RGMII_SDIO_SPI_GPIO (U8.P26), SP2_BUCKs_GPU_LOG_CPU-B (R120.1)
PCIE_REF_CLK_N: RK3399_EMMC_ADC_PCIE (U8.AD30), DDR4_260PIN_Connector (J4.226)
PCIE_REF_CLK_P: RK3399_EMMC_ADC_PCIE (U8.AD31), DDR4_260PIN_Connector (J4.228)
PCIE_RX0_N: RK3399_EMMC_ADC_PCIE (U8.AF31), DDR4_260PIN_Connector (J4.214)
PCIE_RX0_P: RK3399_EMMC_ADC_PCIE (U8.AF30), DDR4_260PIN_Connector (J4.216)
PCIE_RX1_N: RK3399_EMMC_ADC_PCIE (U8.AH31), DDR4_260PIN_Connector (J4.202)
PCIE_RX1_P: RK3399_EMMC_ADC_PCIE (U8.AH30), DDR4_260PIN_Connector (J4.204)
PCIE_RX2_N: RK3399_EMMC_ADC_PCIE (U8.AC28), DDR4_260PIN_Connector (J4.190)
PCIE_RX2_P: RK3399_EMMC_ADC_PCIE (U8.AC27), DDR4_260PIN_Connector (J4.192)
PCIE_RX3_N: RK3399_EMMC_ADC_PCIE (U8.AF28), DDR4_260PIN_Connector (J4.178)
PCIE_RX3_P: RK3399_EMMC_ADC_PCIE (U8.AF27), DDR4_260PIN_Connector (J4.180)
PCIE_TX0_N: RK3399_EMMC_ADC_PCIE (U8.AE31), DDR4_260PIN_Connector (J4.220)
PCIE_TX0_P: RK3399_EMMC_ADC_PCIE (U8.AE30), DDR4_260PIN_Connector (J4.222)
PCIE_TX1_N: RK3399_EMMC_ADC_PCIE (U8.AG31), DDR4_260PIN_Connector (J4.208)
PCIE_TX1_P: RK3399_EMMC_ADC_PCIE (U8.AG30), DDR4_260PIN_Connector (J4.210)
PCIE_TX2_N: RK3399_EMMC_ADC_PCIE (U8.AA28), DDR4_260PIN_Connector (J4.196)
PCIE_TX2_P: RK3399_EMMC_ADC_PCIE (U8.AA27), DDR4_260PIN_Connector (J4.198)
PCIE_TX3_N: RK3399_EMMC_ADC_PCIE (U8.AD28), DDR4_260PIN_Connector (J4.184)
PCIE_TX3_P: RK3399_EMMC_ADC_PCIE (U8.AD27), DDR4_260PIN_Connector (J4.186)
PMIC_EXT_EN: SP1_TYPEC_PWR_IN (R103.1 U13.8), SP2_BUCKs_GPU_LOG_CPU-B (U18.2), SP3_PMIC (U20.55)
PMIC_INT_L: RK3399_RGMII_SDIO_SPI_GPIO (U8.M30), SP3_PMIC (U20.49)
PMIC_SLEEP_H: RK3399_RGMII_SDIO_SPI_GPIO (U8.R30), SP3_PMIC (Q6.1 U20.50)
PWM0_BL: RK3399_RGMII_SDIO_SPI_GPIO (U8.AF5), DDR4_260PIN_Connector (J4.88)
PWR_KEY: PushButton_SYS-LED (SW3.2), DDR4_260PIN_Connector (J4.14), SP3_PMIC (R128.1)
PWR_KEY_L: RK3399_PMU (U8.V27), SP3_PMIC (D5.A)
RECOVERY: RK3399_EMMC_ADC_PCIE (R25.2), PushButton_SYS-LED (SW2.2), DDR4_260PIN_Connector (J4.20)
RESET_IN_H: PushButton_SYS-LED (SW1.2), DDR4_260PIN_Connector (J4.22), SP2_BUCKs_GPU_LOG_CPU-B (Q3.3), SP3_PMIC (C326.2 R122.2 U20.6)
RESET_L: RK3399_PMU (R21.1), SP3_PMIC (R123.2 U20.20)
RTC_BATT_IN: DDR4_260PIN_Connector (J4.18), SP3_PMIC (D7.A1)
RTC_CLKO_SOC: RK3399_PMU (U8.U31), SP3_PMIC (R125.1 U20.68)
SDIO0_CLK: RK3399_RGMII_SDIO_SPI_GPIO (U8.AF7), DDR4_260PIN_Connector (J4.112)
SDIO0_CMD: RK3399_RGMII_SDIO_SPI_GPIO (U8.AH6), DDR4_260PIN_Connector (J4.106)
SDIO0_D0: RK3399_RGMII_SDIO_SPI_GPIO (U8.AD8), DDR4_260PIN_Connector (J4.98)
SDIO0_D1: RK3399_RGMII_SDIO_SPI_GPIO (U8.AK5), DDR4_260PIN_Connector (J4.100)
SDIO0_D2: RK3399_RGMII_SDIO_SPI_GPIO (U8.AG7), DDR4_260PIN_Connector (J4.102)
SDIO0_D3: RK3399_RGMII_SDIO_SPI_GPIO (U8.AE8), DDR4_260PIN_Connector (J4.104)
SDIO0_DETN: RK3399_RGMII_SDIO_SPI_GPIO (U8.AL4), DDR4_260PIN_Connector (J4.108)
SDMMC0_CLK: Wifi_Module (U4.E1), RK3399_EMMC_ADC_PCIE (R24.2)
SDMMC0_CMD: Wifi_Module (U4.A2), RK3399_EMMC_ADC_PCIE (U8.V25)
SDMMC0_D0: Wifi_Module (U4.A1), RK3399_EMMC_ADC_PCIE (U8.Y27)
SDMMC0_D1: Wifi_Module (U4.B2), RK3399_EMMC_ADC_PCIE (U8.Y26)
SDMMC0_D2: Wifi_Module (U4.B1), RK3399_EMMC_ADC_PCIE (U8.Y28)
SDMMC0_D3: Wifi_Module (U4.C2), RK3399_EMMC_ADC_PCIE (U8.U27)
SDMMC0_DET_L: Wifi_Module (R13.2), RK3399_PMU (U8.V28)
SPI1_CLK: RK3399_RGMII_SDIO_SPI_GPIO (U8.P28), DDR4_260PIN_Connector (J4.62)
SPI1_CSn0: RK3399_RGMII_SDIO_SPI_GPIO (U8.P29), DDR4_260PIN_Connector (J4.56)
SPI1_RXD/UART4_RX: RK3399_RGMII_SDIO_SPI_GPIO (U8.P27), DDR4_260PIN_Connector (J4.60)
SPI1_TXD/UART4_TX: RK3399_RGMII_SDIO_SPI_GPIO (U8.R31), DDR4_260PIN_Connector (J4.58)
TYPEC0_D_N: RK3399_USB2_TYPEC_USIC (U8.AH23), USB_TYPEC_Connector (J3.A7 J3.B7)
TYPEC0_D_P: RK3399_USB2_TYPEC_USIC (U8.AG23), USB_TYPEC_Connector (J3.A6 J3.B6)
TYPEC0_RX1_N: RK3399_USB2_TYPEC_USIC (U8.AL21), USB_TYPEC_Connector (J3.B10)
TYPEC0_RX1_P: RK3399_USB2_TYPEC_USIC (U8.AK21), USB_TYPEC_Connector (J3.B11)
TYPEC0_RX2_N: RK3399_USB2_TYPEC_USIC (U8.AL23), USB_TYPEC_Connector (J3.A10)
TYPEC0_RX2_P: RK3399_USB2_TYPEC_USIC (U8.AK23), USB_TYPEC_Connector (J3.A11)
TYPEC0_SBU1: RK3399_USB2_TYPEC_USIC (U8.AK20), USB_TYPEC_Connector (C240.2)
TYPEC0_SBU1_DC: RK3399_USB2_TYPEC_USIC (U8.AH17), USB_TYPEC_Connector (R64.1)
TYPEC0_SBU2: RK3399_USB2_TYPEC_USIC (U8.AL20), USB_TYPEC_Connector (C241.2)
TYPEC0_SBU2_DC: RK3399_USB2_TYPEC_USIC (U8.AG17), USB_TYPEC_Connector (R67.1)
TYPEC0_TX1_N: RK3399_USB2_TYPEC_USIC (U8.AK22), USB_TYPEC_Connector (C111#2.2)
TYPEC0_TX1_P: RK3399_USB2_TYPEC_USIC (U8.AL22), USB_TYPEC_Connector (C124#2.2)
TYPEC0_TX2_N: RK3399_USB2_TYPEC_USIC (U8.AK24), USB_TYPEC_Connector (C125#2.2)
TYPEC0_TX2_P: RK3399_USB2_TYPEC_USIC (U8.AL24), USB_TYPEC_Connector (C140#2.2)
TYPEC0_U2VBUSDET: RK3399_USB2_TYPEC_USIC (R32.2), USB_TYPEC_Connector (D4.K R63.2)
TYPEC1_D_N: RK3399_USB2_TYPEC_USIC (U8.AH24), DDR4_260PIN_Connector (J4.177)
TYPEC1_D_P: RK3399_USB2_TYPEC_USIC (U8.AG24), DDR4_260PIN_Connector (J4.175)
TYPEC1_RX1_N: RK3399_USB2_TYPEC_USIC (U8.AL25), DDR4_260PIN_Connector (J4.189)
TYPEC1_RX1_P: RK3399_USB2_TYPEC_USIC (U8.AK25), DDR4_260PIN_Connector (J4.187)
TYPEC1_RX2_N: RK3399_USB2_TYPEC_USIC (U8.AL27), DDR4_260PIN_Connector (J4.201)
TYPEC1_RX2_P: RK3399_USB2_TYPEC_USIC (U8.AK27), DDR4_260PIN_Connector (J4.199)
TYPEC1_SBU1: RK3399_USB2_TYPEC_USIC (U8.AK29), DDR4_260PIN_Connector (J4.205)
TYPEC1_SBU1_DC: RK3399_USB2_TYPEC_USIC (U8.AE24), DDR4_260PIN_Connector (J4.211)
TYPEC1_SBU2: RK3399_USB2_TYPEC_USIC (U8.AL29), DDR4_260PIN_Connector (J4.207)
TYPEC1_SBU2_DC: RK3399_USB2_TYPEC_USIC (U8.AF25), DDR4_260PIN_Connector (J4.213)
TYPEC1_TX1_N: RK3399_USB2_TYPEC_USIC (U8.AK26), DDR4_260PIN_Connector (J4.183)
TYPEC1_TX1_P: RK3399_USB2_TYPEC_USIC (U8.AL26), DDR4_260PIN_Connector (J4.181)
TYPEC1_TX2_N: RK3399_USB2_TYPEC_USIC (U8.AK28), DDR4_260PIN_Connector (J4.195)
TYPEC1_TX2_P: RK3399_USB2_TYPEC_USIC (U8.AL28), DDR4_260PIN_Connector (J4.193)
TYPEC1_U2VBUSDET: RK3399_USB2_TYPEC_USIC (R34.2), DDR4_260PIN_Connector (J4.215)
UART2DBG_RX: RK3399_RGMII_SDIO_SPI_GPIO (U8.AK2), DDR4_260PIN_Connector (J4.54)
UART2DBG_TX: RK3399_RGMII_SDIO_SPI_GPIO (U8.AJ4), DDR4_260PIN_Connector (J4.52)
VDC_ONOFF: DDR4_260PIN_Connector (J4.16), SP3_PMIC (R126.2)
VDD_CPU_B_FB: RK3399_Power_Pins (U8.N18), SP2_BUCKs_GPU_LOG_CPU-B (R109.1 U17.A4)
VDD_GPU_FB: RK3399_Power_Pins (U8.T15), SP2_BUCKs_GPU_LOG_CPU-B (R108.1 U16.A4)

## Assembly variants
Assembly of RK3399_SOM_BOARD: not fitted C? C? C? C? C? C? C? C? R? R?